# EAGLE design MaxAir Smart Home Gateway WT21-ET01 - v09 (EAGLE 7.7.0)
PiHome - Smart Heating, Ventilation and Air Conditioning (HVAC) Wi-Fi Smart Home Gateway based on MySensors library with NodeMCU and nRF24L01 PA LNA Note: Power by micro USB with minimum 2amp for better performance. For more information on PiHome Smart Heating: http://www.pihome.eu
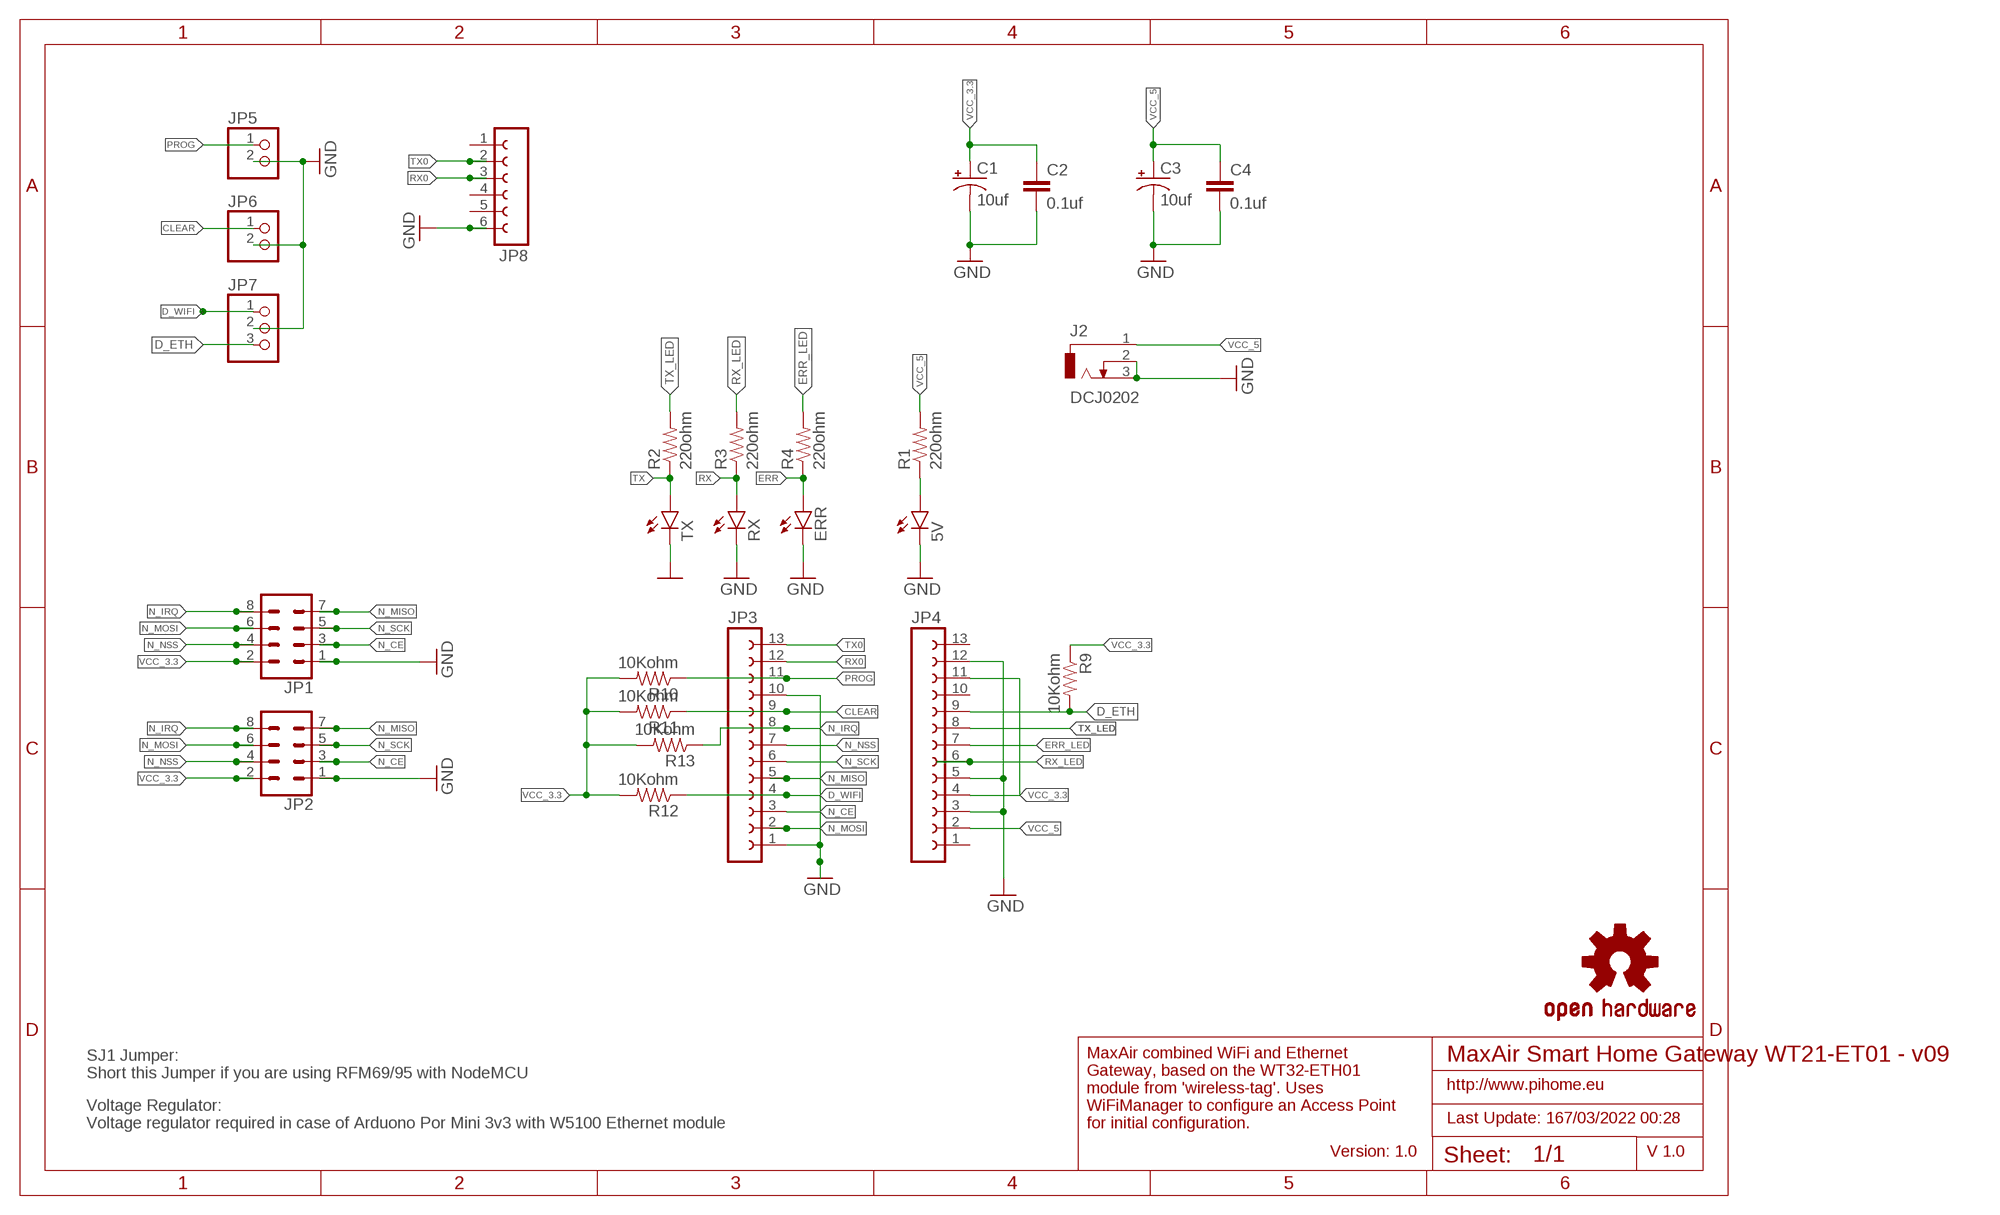
[diagram p0: schematic, sheet 1]

## Parts
5V  LED3MM  [LED3MM]
C1  10uf  10UF-25V-20%(PTH)KIT  [CPOL-RADIAL-10UF-25V-KIT]
C2  0.1uf  0.1UF-50V-20%(PTH)KIT-EZ  [CAP-PTH-SMALL-KIT]
C3  10uf  10UF-25V-20%(PTH)KIT  [CPOL-RADIAL-10UF-25V-KIT]
C4  0.1uf  0.1UF-50V-20%(PTH)KIT-EZ  [CAP-PTH-SMALL-KIT]
ERR  LED3MM  [LED3MM]
J2  DCJ0202  [DCJ0202]
JP1  CONN_04X2  [2X4]
JP2  CONN_04X2  [2X4]
JP3  FE13-1  [FE13]
JP4  FE13-1  [FE13]
JP5  PINHD-1X2  [1X02]
JP6  PINHD-1X2  [1X02]
JP7  PINHD-1X3  [1X03]
JP8  FE06-1  [FE06]
LOGO1  OSHW-LOGOMINI  [OSHW-LOGO-MINI]
R1  220ohm  RESISTORAXIAL-0.3  [AXIAL-0.3]
R2  220ohm  RESISTORAXIAL-0.3  [AXIAL-0.3]
R3  220ohm  RESISTORAXIAL-0.3  [AXIAL-0.3]
R4  220ohm  RESISTORAXIAL-0.3  [AXIAL-0.3]
R9  10Kohm  RESISTORAXIAL-0.3  [AXIAL-0.3]
R10  10Kohm  RESISTORAXIAL-0.3  [AXIAL-0.3]
R11  10Kohm  RESISTORAXIAL-0.3  [AXIAL-0.3]
R12  10Kohm  RESISTORAXIAL-0.3  [AXIAL-0.3]
R13  10Kohm  RESISTORAXIAL-0.3  [AXIAL-0.3]
RX  LED3MM  [LED3MM]
TX  LED3MM  [LED3MM]

## Nets
CLEAR: JP3.9 JP6.1 R11.P$1
D_ETH: JP4.9 JP7.3 R9.P$2
D_WIFI: JP3.4 JP7.1 R12.P$1
ERR: ERR.A R4.P$1
ERR_LED: JP4.7 R4.P$2
GND: 5V.K(C) C1.2(-) C2.2 C3.2(-) C4.2 ERR.K(C) J2.2 J2.3 JP1.1 JP2.1 JP3.1 JP3.10 JP4.3 JP4.5 JP4.12 JP5.2 JP6.2 JP7.2 JP8.6 RX.K(C) TX.K(C)
N$1: 5V.A R1.P$1
N_CE: JP1.3 JP2.3 JP3.3
N_IRQ: JP1.8 JP2.8 JP3.8 R13.P$1
N_MISO: JP1.7 JP2.7 JP3.5
N_MOSI: JP1.6 JP2.6 JP3.2
N_NSS: JP1.4 JP2.4 JP3.7
N_SCK: JP1.5 JP2.5 JP3.6
PROG: JP3.11 JP5.1 R10.P$1
RX: R3.P$1 RX.A
RX0: JP3.12 JP8.3
RX_LED: JP4.6 R3.P$2
TX: R2.P$1 TX.A
TX0: JP3.13 JP8.2
TX_LED: JP4.8 R2.P$2
VCC_3.3: C1.1(+) C2.1 JP1.2 JP2.2 JP4.4 JP4.11 R9.P$1 R10.P$2 R11.P$2 R12.P$2 R13.P$2
VCC_5: C3.1(+) C4.1 J2.1 JP4.2 R1.P$2
Unconnected: JP4.1 JP4.10 JP4.13 JP8.1 JP8.4 JP8.5

## Notes on the sheet
- SJ1 Jumper:
  Short this Jumper if you are using RFM69/95 with NodeMCU
- http://www.pihome.eu
- Last Update: 167/03/2022 00:28
- Voltage Regulator:
  Voltage regulator required in case of Arduono Por Mini 3v3 with W5100 Ethernet module
- MaxAir combined WiFi and Ethernet
  Gateway, based on the WT32-ETH01
  module from 'wireless-tag'. Uses
  WiFiManager to configure an Access Point
  for initial configuration.
- Version: 1.0 | V 1.0

## Library data of the parts
5V ERR RX TX = SparkFun-LED:LED: LEDs Standard schematic elements and footprints for 5mm, 3mm, 1206, and 0603 sized LEDs. 5mm - Spark Fun Electronics SKU : COM-00529 (and others); PROD_ID: DIO-08794
C1 C3 = SparkFun-Capacitors:10UF-25V-20%(PTH): CAP-08440; PROD_ID: CAP-08440
C2 C4 = SparkFun-Capacitors:0.1UF-50V-20%(PTH): CAP-08370; PROD_ID: CAP-08370
J2 = con-jack:DCJ0202: DC POWER JACK Source: DCJ0202.pdf; OC_FARNELL: unknown; OC_NEWARK: unknown
JP1 JP2 = SparkFun-Connectors:CONN_04X2: Multi connection point. Often used as Generic Header-pin footprint for 0.1 inch spaced/style header connections On any of the 0.1 inch spaced packages, you can populate with these: Break Away Headers - Straight <https://www.sparkfun.com/products/116> (PRT-00116) Break Away Male Headers - Right Angle <https://www.sparkfun.com/products/553> (PRT-00553) Female Headers <https://www.sparkfun.com/products/115> (PRT-00115) Break Away Headers - Machine Pin <https://www.sparkfun.com/products/117> (PRT-00117) Break Away Female Headers - Swiss Machine Pin <https://www.sparkfun.com/products/743> (PRT-00743)
JP3 JP4 = con-lsta:FE13-1: FEMALE HEADER; OC_FARNELL: unknown; OC_NEWARK: unknown
JP5 JP6 = pinhead:PINHD-1X2: PIN HEADER
JP7 = pinhead:PINHD-1X3: PIN HEADER
JP8 = con-lsta:FE06-1: FEMALE HEADER; OC_FARNELL: unknown; OC_NEWARK: unknown
LOGO1 = SparkFun-Aesthetics@1:OSHW-LOGO: Open-Source Hardware (OSHW) Logo This logo indicates the piece of hardware it is found on incorporates a OSHW license and/or adheres to the definition of open source hardware found here: http://freedomdefined.org/OSHW
R1-R4 R9-R13 = SparkFun-Passives:RESISTOR: Resistor Basic schematic elements and footprints for 0603, 1206, and PTH resistors.

## Net classes
0 default: width 0.254 mm, drill 0.076 mm, clearance 0.205 mm

## Board
PiHome - Smart Heating, Ventilation and Air Conditioning (HVAC) Wi-Fi Smart Home Gateway based on MySensors library with NodeMCU and nRF24L01 PA LNA Note: Power by micro USB with minimum 2amp for better performance. For more information on PiHome Smart Heating: http://www.pihome.eu
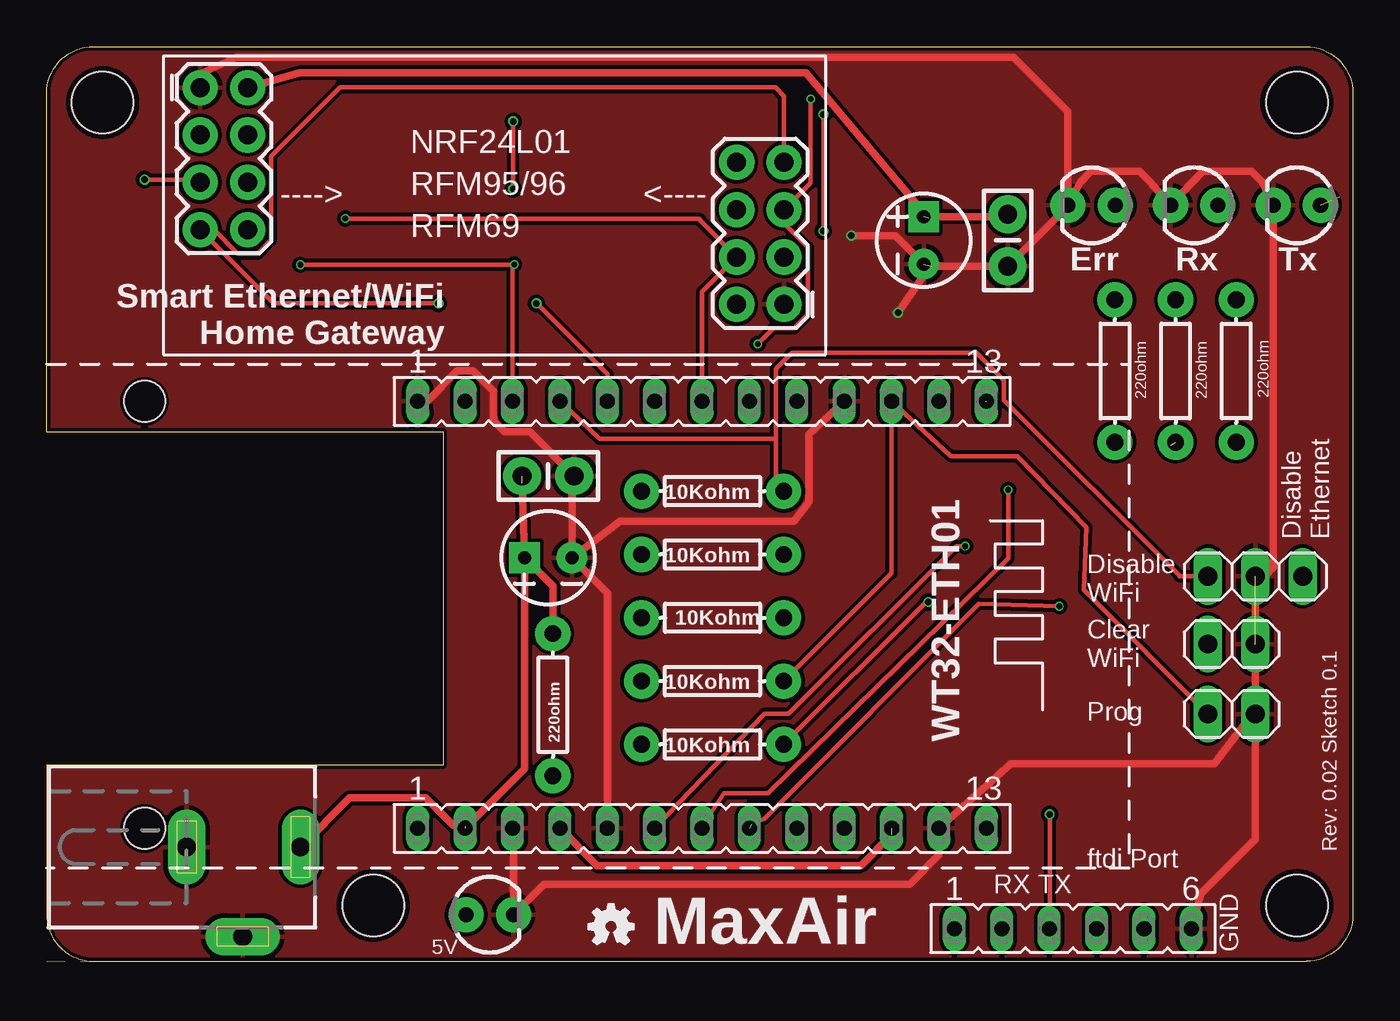
[diagram p1: board, top side]
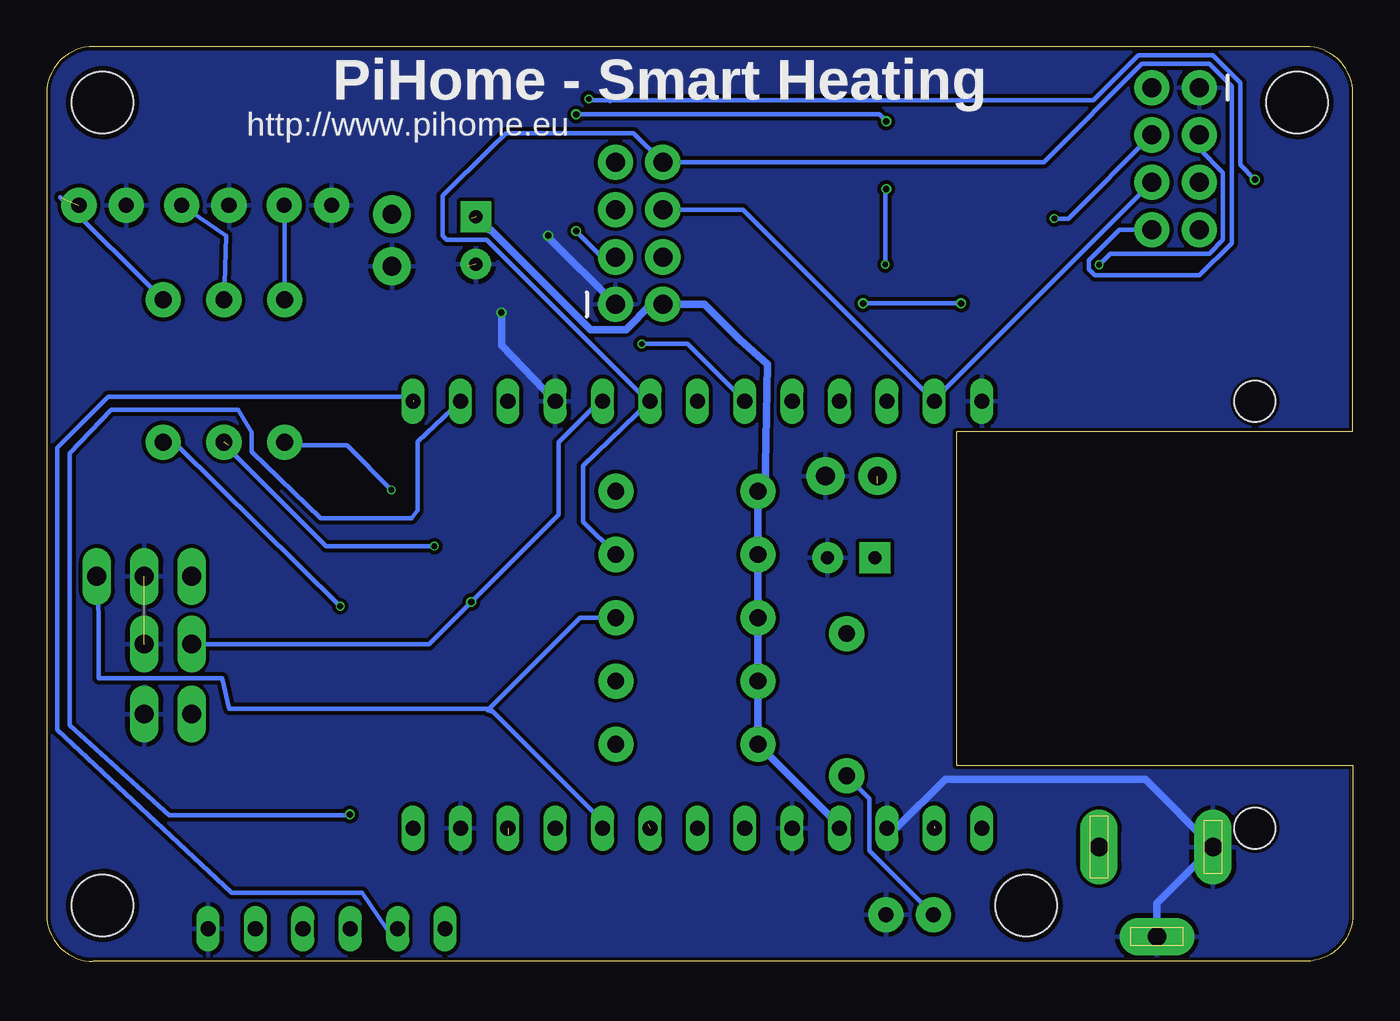
[diagram p2: board, bottom side, seen from below]

Size 70 x 49 mm. Coordinates in mm from the lower left corner, seen from the top.
Outline: 2.5,0 67.5,0 arc90 70,2.5 70,46.5 arc90 67.5,49 2.5,49 arc90 0,46.5 0,28.38 21.25,28.38 21.25,10.5 0,10.5 0,2.55 arc90 2.5,0
Copper layers (1*16): Top 0.035559375mm / dielectric 1.6mm / Bottom 0.035559375mm
Design rules "PiHome - JLCPCB 2 Layer": minimum track width 5mil, minimum drill 12mil, track to track 5mil, track to pad 5mil, pad to pad 5mil, via to via 5mil, smd to smd 5mil, copper to edge 8mil, drill to drill 6mil, minimum pad ring 5mil, minimum via ring 3mil, stop-mask expansion 2.5mil, vias tented up to drill 0mil, thermal gap 10mil
Holes 2.2 mm at 5.25,30 5.25,7.12

### Footprints (pad centres in the part's own frame; a part is rotated, then mirrored left to right if it is on the bottom)
LED3MM = drill 0.813 pad 1.88: A -1.27,0; K 1.27,0
CPOL-RADIAL-10UF-25V-KIT = drill 0.7 pad 1.651 square: 1 1.27,0 | drill 0.7 pad 1.651: 2 -1.27,0
CAP-PTH-SMALL-KIT = drill 1.016 pad 2.032: 1 -1.397,0; 2 1.397,0
DCJ0202 = drill 1 pad 2 long: 1 0,3.1; 2 4.8,0; 3 0,-3
2X4 = drill 1.016 pad 1.88: 1 -3.81,-1.27; 2 -3.81,1.27; 3 -1.27,-1.27; 4 -1.27,1.27; 5 1.27,-1.27; 6 1.27,1.27; 7 3.81,-1.27; 8 3.81,1.27
FE13 = drill 0.813 long: 1 -15.24,0; 2 -12.7,0; 3 -10.16,0; 4 -7.62,0; 5 -5.08,0; 6 -2.54,0; 7 0,0; 8 2.54,0; 9 5.08,0; 10 7.62,0; 11 10.16,0; 12 12.7,0; 13 15.24,0
1X02 = drill 1.016 long: 1 -1.27,0; 2 1.27,0
1X03 = drill 1.016 long: 1 -2.54,0; 2 0,0; 3 2.54,0
FE06 = drill 0.813 long: 1 -6.35,0; 2 -3.81,0; 3 -1.27,0; 4 1.27,0; 5 3.81,0; 6 6.35,0
AXIAL-0.3 = drill 0.9 pad 1.88: P$1 -3.81,0; P$2 3.81,0
STAND-OFF = hole 3.302: 0,0

### Placement (x,y rotation side)
5V  23.75,2.5 0 top
C1  47,38.62 90 top
C2  51.5,38.62 270 top
C3  26.88,21.62 180 top
C4  26.88,26 0 top
ERR  56,40.5 180 top
J2  10.5,6.12 270 top
JP1  38.25,39 90 top
JP2  9.5,43 270 top
JP3  35.12,30 0 top
JP4  35.12,7.12 0 top
JP5  63.5,13.25 0 top
JP6  63.5,17 0 top
JP7  64.77,20.62 0 top
JP8  55,1.75 0 top
LOGO1  30.25,1.88 0 top
R1  27.12,13.75 90 top
R2  63.75,31.62 270 top
R3  60.5,31.62 270 top
R4  57.25,31.62 270 top
R9  35.69,18.41 0 top
R10  35.69,15.02 180 top
R11  35.69,11.62 180 top
R12  35.69,25.18 180 top
R13  35.69,21.8 180 top
RX  61.5,40.5 180 top
TX  67,40.5 180 top
U$1  [STAND-OFF]  3,46 0 top
U$2  [STAND-OFF]  17.5,3 0 top
U$4  [STAND-OFF]  67,46 0 top
U$5  [STAND-OFF]  67,3 0 top

### Tracks (layer width: path | path; a pad name or v marks a point on that pad's centre or on a via)
CLEAR  (via drill 0.35)
  Top 0.254: R11.P$1 47.12,19.25 v47.25,19.25
  Bottom 0.254: v47.26,19.25 47.07,19.44 | 47.07,19.44 42.58,23.93 42.58,27.81 40.37,30.01 JP3.9 | v47.25,19.26 47.28,19.26 47.28,19.21 v47.25,19.25 | v47.25,19.25 47.07,19.43 47.07,19.44 | v47.25,19.25 49.5,17 JP6.1
D_ETH
  Bottom 0.254: JP4.9 40.2,7.5 46.15,13.44 | 46.16,13.46 46.15,13.44 | R9.P$2 41.42,18.41 46.29,13.54 | 46.29,13.54 46.38,13.45 46.28,13.45 46.2,13.39 46.15,13.44 | 46.29,13.54 60.22,13.54 60.61,15.17 65.21,15.17 67.21,15.17 67.21,18.53 JP7.3
D_WIFI
  Top 0.254: 39.08,28 39.08,31.74 39.94,32.6 49.83,32.6 51.31,31.12 51.31,30.07 60.75,20.62 | 39.08,28 39.08,25.61 R12.P$1 | JP3.4 29.63,28 39.08,28 | 60.69,20.62 60.75,20.62 | 60.75,20.62 JP7.1
ERR
  Bottom 0.254: ERR.A 57.25,38.75 R4.P$1
ERR_LED  (via drill 0.3)
  Top 0.254: v51.53,25.26 51.53,21.59 38.65,9 36.31,9 35.21,7.33 35.19,7.34 JP4.7
  Bottom 0.254: v51.53,25.26 53.91,27.64 57.21,27.64 R4.P$2
GND  (via drill 0.35)  (2 unrouted)
  Top 0.406: JP4.3 25.24,6.99 25,7.11 | JP2.1 8.23,47.56 10.19,48.43 51.82,48.43 54.73,45.52 ERR.K | ERR.K 55.4,41.75 55.97,42.32 58.57,42.32 59.14,41.75 RX.K 61.4,41.75 61.97,42.32 64.57,42.32 65.14,41.75 TX.K 65.73,21.09 64.77,20.12 JP6.2 JP5.2 | JP5.2 64.61,13.25 62.58,10.6 51.67,10.6 JP4.12 47.83,5.7 46.25,4.12 26.64,4.12 5V.K 25.02,7.07 JP4.3 | JP8.6 61.85,3.62 64.77,6.54 JP5.2 | C3.2 28.14,25.63 C4.2 25.9,28.37 24.54,28.37 23.95,28.97 23.95,30.53 22.85,31.63 22,31.63 20.38,30 JP3.1 | JP3.10 40.85,28.23 40.85,24.63 40.06,23.59 30.73,23.59 C3.2 | 47.44,37.23 C2.2 54.73,40.46 ERR.K | v45.62,34.75 47,36.75 C1.2 45.48,38.88 v43.12,38.88 | JP4.3 25.08,7.25 | JP4.5 30.05,19.73 C3.2
  Bottom 0.406: JP3.10 45.62,33.01 v45.62,34.75 | JP1.1 43.12,38.8 v43.12,38.88 | JP4.3 24.47,7.12 21.85,9.75 11.13,9.75 J2.3 10.5,3.12 J2.2
  pour Top: 0,0 0,10.5 21.25,10.5 21.25,28.38 0,28.38 0,49 70,49 70,0
  pour Bottom: 0,0 70,0 70,49 0,49 0,28.38 21.25,28.38 21.25,10.5 19.78,10.5 0,10.5
N$1
  Bottom 0.254: R1.P$1 25.91,8.72 25.91,5.93 5V.A
N_CE  (via drill 0.3, 0.35)
  Top 0.254: v25.05,37.33 | v25.05,37.33 13.85,37.33 v13.59,37.32 | JP3.3 24.96,37.24 v25.05,37.33 | v25,41.38 v25,45 | v41.62,45.38 v41.62,39.12
  Bottom 0.254: v13.59,37.32 12.99,37.92 7.7,37.92 6.96,38.66 6.96,42.26 8.23,43.53 JP2.3 | v25.05,37.33 25.05,41.32 v25,41.38 | v25,45 25.38,45.38 v41.62,45.38 | v41.62,39.12 40.23,37.73 JP1.3
N_IRQ
  Bottom 0.254: R13.P$1 41.25,23.55 41.25,26.54 JP3.8 37.78,30.01 46.42,38.65 48.58,38.65 48.79,38.86 48.79,41.02 46.2,43.55 45.38,44.38 38.55,44.38 JP1.8 16.57,42.81 11.3,48.08 7.7,48.08 6.5,46.88 6.5,38.47 8.22,36.76 13.82,36.76 14.15,37.08 14.15,37.55 12.51,39.19 JP2.8
N_MISO  (via drill 0.35)
  Top 0.254: JP1.7 39.52,46.35 39.05,46.83 15.74,46.83 12.04,43.13 12.04,38.66 11.3,37.92 10.24,37.92 8.97,39.19 JP2.7 12.17,35.25 v21,35.25 | v26.25,35.25 30.05,31.45 JP3.5
  Bottom 0.254: v21,35.25 v26.25,35.25
N_MOSI
  Bottom 0.254: JP3.2 22.45,30.23 22.55,30.32 22.18,30.32 JP2.6 | JP3.2 22.43,30.48 | JP3.2 32.7,40.27 JP1.6
N_NSS  (via drill 0.3)
  Top 0.254: 35.19,30.23 JP3.7 35.12,35.88 JP1.4 35,39.71 35,39.75 34.96,39.79 v16,39.79
  Bottom 0.254: v16,39.79 15.25,39.79 JP2.4
N_SCK  (via drill 0.3, 0.35)
  Top 0.254: v5.25,41.88 8.09,41.88 JP2.5 | v40.94,46.2 40.94,41.69 39.56,40.31 | 39.56,40.31 JP1.5 | v38.11,33.08 38.95,33.92 40.05,33.92 40.79,34.66 40.79,38.26 39.56,39.49 39.56,40.31
  Bottom 0.254: 39.82,46.08 39.87,46.13 | v40.94,46.2 40.87,46.13 39.87,46.13 | v5.25,41.88 6.04,42.66 6.04,47.07 7.51,48.54 11.49,48.54 13.9,46.13 39.87,46.13 | JP3.6 35.66,33.08 v38.11,33.08
PROG
  Top 0.254: JP3.11 45.28,20.8 R10.P$1 | 45.34,30.01 JP3.11 | 61.63,13.78 61.7,13.78 JP5.1 55.58,19.9 55.71,23.25 52.01,27.07 48.46,27.07 JP3.11
RX
  Bottom 0.254: R3.P$1 60.38,38.86 RX.A
RX0  (via drill 0.35)
  Top 0.254: v53.75,7.88 53.75,1.77 JP8.3
  Bottom 0.254: JP3.12 50.12,27.83 50.12,24.16 50.44,23.75 55.32,23.75 59.01,27.3 59.01,28.33 59.74,29.56 66.53,29.56 68.75,27.21 68.75,12.65 63.43,7.82 | 63.43,7.82 63.48,7.88 | 63.43,7.82 53.8,7.82 v53.75,7.88
RX_LED  (via drill 0.3)  (1 unrouted)
  Top 0.254: JP4.6 38.47,13.26 39.76,13.26 48.74,22.24 v49.23,22.24
  Bottom 0.254: v49.23,22.24 55.03,22.24 60.43,27.64 60.24,27.64
TX  (1 unrouted)
  Bottom 0.254: R2.P$1 69.27,40.94
TX0  (1 unrouted)
  Bottom 0.254: JP3.13 50.48,30.24 66.71,30.24 69.43,27.52 69.43,12.41 60.08,3.68 53.09,3.68 51.79,1.75 JP8.2
TX_LED  (via drill 0.3)  (1 unrouted)
  Top 0.254: v54.27,19.02 49.96,19.15 38.47,7.65 37.77,7.41 | 37.77,7.41 37.54,7.38 | 37.78,7.34 37.77,7.41
  Bottom 0.254: v54.27,19.02 63.01,27.64 63.69,27.64 R2.P$2
VCC_3.3  (3 unrouted)
  Top 0.406: C1.1 51.5,39.9 C2.1 | 45.28,6.79 43.62,5.12 29.5,5.12 JP4.4 | 47.25,39.8 40.7,47.6 13.56,47.6 JP2.2
  Bottom 0.254: R9.P$1 31.95,18.57 31.88,18.57 | 31.88,21.59 31.95,21.59 R13.P$2
  Bottom 0.406: C1.1 46.29,39.18 46.2,39.18 40.86,33.84 38.96,33.84 37.61,35.19 JP1.2 34.75,35.19 32.88,33.31 31.38,32 31.5,25.18 R12.P$2 R13.P$2 31.88,21.59 31.88,18.57 R9.P$1 R10.P$2 R11.P$2 27.5,7.25 JP4.4
VCC_5  (via drill 0.6)  (2 unrouted)
  Top 0.406: C3.1 25.6,21.76 25.49,25.62 | C3.1 25.61,10.3 22.59,7.29 | 22.59,7.29 JP4.2 | C3.1 27.12,20.11 R1.P$2 | 22.59,7.29 21.77,7.29 20.31,8.75 16.23,8.75 J2.1
  other vias: 22.43,7.25

### Text on the board
tPlace: NRF24L01 | RFM95/96 | ----> | <---- | RFM69 | Err | Rx | Tx | Smart Ethernet/WiFi / Home Gateway | Disable / Ethernet | Disable / WiFi | Clear / WiFi | Prog | WT32-ETH01 | Rev: 0.02 Sketch 0.1 | ftdi Port | MaxAir
bPlace: PiHome - Smart Heating | http://www.pihome.eu
tNames: RX | TX | GND
tValues: 0.1uf | 0.1uf